# EAGLE design Schaltplan_6011057 Tamme (EAGLE 7.2.0)
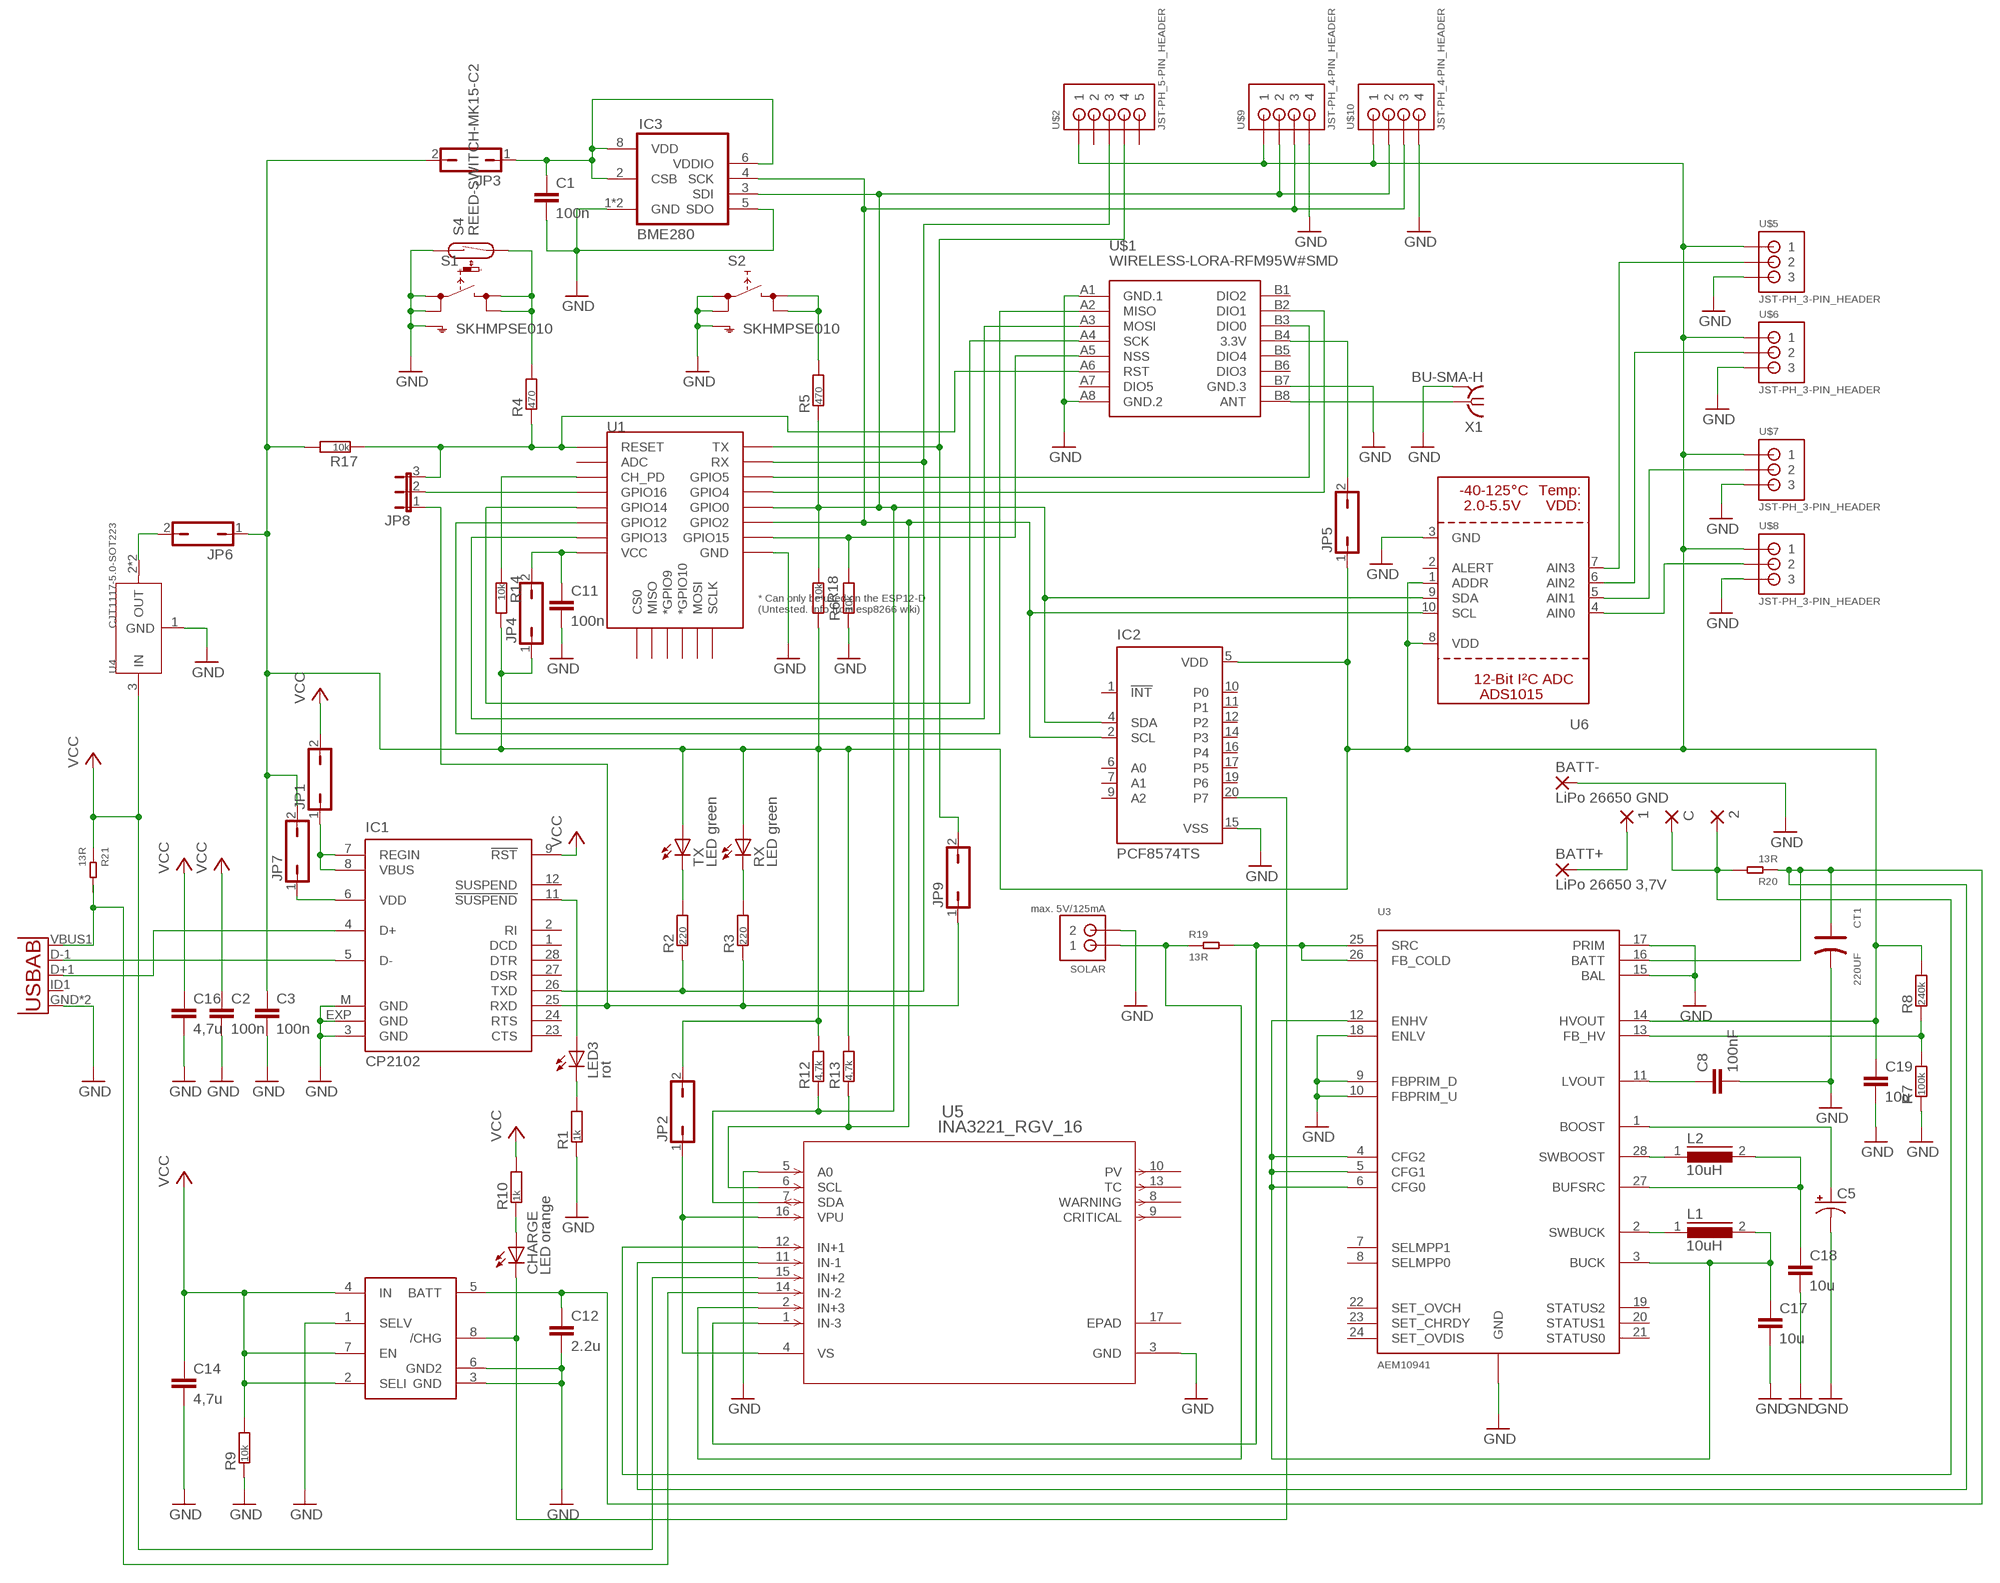
[diagram p0: schematic, sheet 1]

## Parts
1  WIREPAD2,54/1,0  [2,54/1,0]
2  WIREPAD2,54/1,0  [2,54/1,0]
BATT+  LiPo 26650 3,7V  WIREPAD4,16O1,6  [4,16O1,6]
BATT-  LiPo 26650 GND  WIREPAD4,16O1,6  [4,16O1,6]
C  WIREPAD2,54/1,0  [2,54/1,0]
C1  100n  CAPACITOR_0805_M  [RESC0805_M]
C2  100n  CAPACITOR_0805_M  [RESC0805_M]
C3  100n  CAPACITOR_0805_M  [RESC0805_M]
C5  CPOL-USB/3528-21W  [B/3528-21W]
C8  100nF  CC1206  [C1206]
C11  100n  CAPACITOR_0805_M  [RESC0805_M]
C12  2.2u  C-EUC1812  [C1812]
C14  4,7u  C-EUC1812  [C1812]
C16  4,7u  C-EUC1812  [C1812]
C17  10u  C-EUC1812  [C1812]
C18  10u  C-EUC1812  [C1812]
C19  10u  C-EUC1812  [C1812]
CHARGE  LED orange  LEDSMT1206  [1206]
CT1  220UF  ALUMINUM-SMD-220UF-16V(D6.3-H7.7MM)  [ELECTRO-SMD-C-6MM]
IC1  CP2102  [MLP28]
IC2  PCF8574TS  [SSOP20]
IC3  BME280  [BME280]
JP1  JP1Q  [JP1]
JP2  JP1Q  [JP1]
JP3  JP1Q  [JP1]
JP4  JP1Q  [JP1]
JP5  JP1Q  [JP1]
JP6  JP1Q  [JP1]
JP7  JP1Q  [JP1]
JP8  JP2E  [JP2]
JP9  JP1Q  [JP1]
L1  10uH  DR74  [DR74]
L2  10uH  DR74  [DR74]
LED3  rot  LEDSMT1206  [1206]
R1  1k  RESISTOR_0805_M  [RESC0805_M]
R2  220  RESISTOR_0805_M  [RESC0805_M]
R3  220  RESISTOR_0805_M  [RESC0805_M]
R4  470  RESISTOR_0805_M  [RESC0805_M]
R5  470  RESISTOR_0805_M  [RESC0805_M]
R6  10k  RESISTOR_0805_M  [RESC0805_M]
R7  100k  RESISTOR_0805_M  [RESC0805_M]
R8  240k  RESISTOR_0805_M  [RESC0805_M]
R9  10k  RESISTOR_0805_M  [RESC0805_M]
R10  1k  RESISTOR_0805_M  [RESC0805_M]
R12  4,7k  RESISTOR_0805_M  [RESC0805_M]
R13  4,7k  RESISTOR_0805_M  [RESC0805_M]
R14  10k  RESISTOR_0805_M  [RESC0805_M]
R17  10k  RESISTOR_0805_M  [RESC0805_M]
R18  10k  RESISTOR_0805_M  [RESC0805_M]
R19  13R  SMD-RES-13R-5%-1/4W(1206)  [R1206]
R20  13R  SMD-RES-13R-5%-1/4W(1206)  [R1206]
R21  13R  SMD-RES-13R-5%-1/4W(1206)  [R1206]
RX  LED green  LEDSMT1206  [1206]
S1  SKHMPSE010  [SKHMPXE010]
S2  SKHMPSE010  [SKHMPXE010]
S4  REED-SWITCH-MK15-C2  [MK15]
SOLAR  max. 5V/125mA  JST-PH_2-PIN_HEADER  [JST_B2B-PH_HEADER]
TX  LED green  LEDSMT1206  [1206]
U1  ESP12ESMD  [ESP12E-SMD]
U2  USB""  [USB-MICRO-SMD]
U3  AEM10941  [QFN28_5X5_05PITCH]
U4  CJT1117-5.0-SOT223  PMIC-CJT1117-5.0(SOT223)  [SOT-223]
U5  INA3221_RGV_16  [RGV16_2P16X2P16]
U6  ADC_ADS1015  [MSOP10]
U$1  WIRELESS-LORA-RFM95W#SMD  [WIRELESS-LORA-RFM95W#SMD]
U$2  JST-PH_5-PIN_HEADER  [JST_B5B-PH_HEADER]
U$3  MAX1811SO8  [SO08]
U$5  JST-PH_3-PIN_HEADER  [JST_B3B-PH_HEADER]
U$6  JST-PH_3-PIN_HEADER  [JST_B3B-PH_HEADER]
U$7  JST-PH_3-PIN_HEADER  [JST_B3B-PH_HEADER]
U$8  JST-PH_3-PIN_HEADER  [JST_B3B-PH_HEADER]
U$9  JST-PH_4-PIN_HEADER  [JST_B4B-PH_HEADER]
U$10  JST-PH_4-PIN_HEADER  [JST_B4B-PH_HEADER]
X1  BU-SMA-H  [BU-SMA-H]

## Nets
3.3V: C3.1 C19.1 IC2.5(VDD) JP2.2 JP3.2 JP4.1 JP5.1 JP6.1 JP7.2 R8.2 R12.2 R13.2 R14.2 R17.2 R18.2 RX.A TX.A U3.14(HVOUT) U6.1(ADDR) U6.8(VDD) U$2.P1 U$5.P1 U$6.P1 U$7.P1 U$8.P1 U$9.P1 U$10.P1
GND: BATT-.1(P) C1.2 C2.2 C3.2 C5.- C8.2 C11.2 C12.2 C14.2 C16.2 C17.2 C18.2 C19.2 CT1.- IC1.3(GND) IC1.EXP(GND) IC1.M(GND) IC2.15(VSS) IC3.1(GND) IC3.5(SDO) IC3.7(GND) R1.1 R6.1 R7.1 R9.1 S1.1(1.1) S1.2(1.2) S1.5(SH) S2.1(1.1) S2.2(1.2) S2.5(SH) S4.1 SOLAR.P2 U1.GND U2.GND U2.GND1(GND) U3.9(FBPRIM_D) U3.10(FBPRIM_U) U3.15(BAL) U3.17(PRIM) U3.18(ENLV) U3.GND U3.GND1(GND) U3.GND2(GND) U3.GND3(GND) U3.GND4(GND) U3.GND5(GND) U4.1(GND) U5.3(GND) U5.5(A0) U6.3(GND) U$1.A1(GND.1) U$1.A8(GND.2) U$1.B7(GND.3) U$3.1(SELV) U$3.3(GND) U$3.6(GND2) U$5.P3 U$6.P3 U$7.P3 U$8.P3 U$9.P4 U$10.P4 X1.2 X1.3 X1.4 X1.5
N$1: U$1.B8(ANT) X1.1
N$2: R6.2 U1.GPIO15 U$1.A5(NSS)
N$3: R4.2 S1.3(2.1) S1.4(2.2) S4.2
N$4: JP8.3 R4.1 R17.1 U1.RESET U$1.A6(RST)
N$5: IC1.4(D+) U2.D+1(D+)
N$6: IC1.5(D-) U2.D-1(D-)
N$7: JP8.2 U1.GPIO16
N$8: LED3.C R1.2
N$9: IC1.25(RXD) JP8.1 JP9.1 R3.1
N$10: IC1.26(TXD) R2.1 U1.RXD0(RX) U$2.P3
N$11: IC1.11(!SUSPEND) LED3.A
N$12: R2.2 TX.C
N$13: R3.2 RX.C
N$14: R5.2 S2.3(2.1) S2.4(2.2)
N$15: U1.GPIO12 U$1.A2(MISO)
N$16: U1.GPIO14 U$1.A4(SCK)
N$17: C12.1 CT1.+ R20.1 U3.16(BATT) U5.11(IN-1) U$3.5(BATT)
N$19: U1.GPIO13 U$1.A3(MOSI)
N$20: JP9.2 U1.TXD0(TX) U$2.P4
N$21: JP6.2 U4.2(OUT) U4.TER(OUT)
N$22: U6.4(AIN0) U$8.P2
N$23: C17.1 L1.2 U3.3(BUCK) U3.4(CFG2) U3.5(CFG1) U3.6(CFG0) U3.12(ENHV)
N$24: C5.+ U3.1(BOOST)
N$25: C18.1 L2.2 U3.27(BUFSRC)
N$26: R7.2 R8.1 U3.13(FB_HV)
N$27: C1.1 IC3.2(CSB) IC3.6(VDDIO) IC3.8(VDD) JP3.1
N$28: IC2.4(SDA) IC3.3(SDI) R5.1 R12.1 R18.1 U1.GPIO0 U5.7(SDA) U6.9(SDA) U$9.P2 U$10.P2
N$29: IC2.2(SCL) IC3.4(SCK) R13.1 U1.GPIO2 U5.6(SCL) U6.10(SCL) U$9.P3 U$10.P3
N$30: C8.1 U3.11(LVOUT)
N$31: 2.1(P) C.1(P) R20.2 U5.12(IN+1)
N$32: U6.5(AIN1) U$7.P2
N$33: U6.6(AIN2) U$6.P2
N$34: U6.7(AIN3) U$5.P2
N$36: R19.1 SOLAR.P1 U5.2(IN+3)
N$37: CHARGE.C IC2.20(P7) U$3.8(/CHG)
N$38: CHARGE.A R10.1
N$40: R19.2 U3.25(SRC) U3.26(FB_COLD) U5.1(IN-3)
N$41: U2.VBUS1(VBUS) U5.14(IN-2)
N$42: IC1.7(REGIN) IC1.8(VBUS) JP1.1
N$43: C11.1 JP4.2 U1.VCC
N$44: JP2.1 U5.4(VS) U5.16(VPU)
N$45: JP5.2 U$1.B4(3.3V)
N$46: U1.GPIO4 U$1.B2(DIO1)
N$47: U1.GPIO5 U$1.B3(DIO0)
N$49: L2.1 U3.28(SWBOOST)
N$50: L1.1 U3.2(SWBUCK)
N$52: R14.1 U1.CH_PD
N$59: IC1.6(VDD) JP7.1
N$60: 1.1(P) BATT+.1(P)
VCC: C2.1 C14.1 C16.1 IC1.9(!RST) JP1.2 R9.2 R10.2 R21.1 U4.3(IN) U5.15(IN+2) U$3.2(SELI) U$3.4(IN) U$3.7(EN)
Unconnected: IC1.1(DCD) IC1.2(RI) IC1.12(SUSPEND) IC1.23(CTS) IC1.24(RTS) IC1.27(DSR) IC1.28(DTR) IC2.1(!INT) IC2.6(A0) IC2.7(A1) IC2.9(A2) IC2.10(P0) IC2.11(P1) IC2.12(P2) IC2.14(P3) IC2.16(P4) IC2.17(P5) IC2.19(P6) R21.2 U1.ADC U1.CS0 U1.GPIO9(*GPIO9) U1.GPIO10(*GPIO10) U1.MISO U1.MOSI U1.SCLK U2.ID1(USBID) U3.7(SELMPP1) U3.8(SELMPP0) U3.19(STATUS2) U3.20(STATUS1) U3.21(STATUS0) U3.22(SET_OVCH) U3.23(SET_CHRDY) U3.24(SET_OVDIS) U5.8(WARNING) U5.9(CRITICAL) U5.10(PV) U5.13(TC) U5.17(EPAD) U6.2(ALERT) U$1.A7(DIO5) U$1.B1(DIO2) U$1.B5(DIO4) U$1.B6(DIO3) U$2.P2 U$2.P5

## Library data of the parts
1 2 BATT+ BATT- C = wirepad:WIREPAD: Wire PAD connect wire on PCB
C1-C3 C11 = Nordic_nRF:CAPACITOR: Generic chip capacitor
C5 = adafruit:CPOL-US: POLARIZED CAPACITOR, American symbol
C8 = eagle-ltspice:C: CAPACITOR, European symbol; SPICEMODEL: NONE; SPICEPREFIX: C
C12 C14 C16-C19 = rcl:C-EU: CAPACITOR, European symbol
CHARGE LED3 RX TX = led diymodules:LED: LED OSRAM: - CHIPLED LG R971, LG N971, LY N971, LG Q971, LY Q971, LO R971, LY R971 LH N974, LH R974 LS Q976, LO Q976, LY Q976 LO Q996 - Hyper CHIPLED LW Q18S LB Q993, LB Q99A, LB R99A - SideLED LS A670, LO A670, LY A670, LG A670, LP A670 LB A673, LV A673, LT A673, LW A673 LH A674 LY A675 LS A676, LA A676, LO A676, LY A676, LW A676 LS A679, LY A679, LG A679 - Hyper Micro SIDELED® LS Y876, LA Y876, LO Y876, LY Y876 LT Y87S - SmartLED LW L88C, LW L88S LB L89C, LB L89S, LG L890 LS L89K, LO L89K, LY L89K LS L896, LA L896, LO L896, LY L896 - TOPLED LS T670, LO T670, LY T670, LG T670, LP T670 LSG T670, LSP T670, LSY T670, LOP T670, LYG T670 LG T671, LOG T671, LSG T671 LB T673, LV T673, LT T673, LW T673 LH T674 LS T676, LA T676, LO T676, LY T676, LB T676, LH T676, LSB T676, LW T676 LB T67C, LV T67C, LT T67C, LS T67K, LO T67K, LY T67K, LW E67C LS E67B, LA E67B, LO E67B, LY E67B, LB E67C, LV E67C, LT E67C LW T67C LS T679, LY T679, LG T679 LS T770, LO T770, LY T770, LG T770, LP T770 LB T773, LV T773, LT T773, LW T773 LH T774 LS E675, LA E675, LY E675, LS T675 LS T776, LA T776, LO T776, LY T776, LB T776 LHGB T686 LT T68C, LB T68C - Hyper Mini TOPLED® LB M676 - Mini TOPLED Santana® LG M470 LS M47K, LO M47K, LY M47K Source: http://www.osram.convergy.de/
CT1 = Seeed-Capacitor:ALUMINUM-SMD-220UF-16V(D6.3-H7.7MM): 302030053; MPN: CS1E221M-CRE77
IC1 = silabs:CP210*: Single-Chip USB to UART Bridge Source: www.silabs.com .. CP2101.pdf / cp2102.pdf; MF: FARNELL; MPN: CP2102-GM; OC_FARNELL: 9282130; OC_NEWARK: 30K5635
IC2 = micro-philips:PCF8574: I2C-Bus Remote 8-bit I/O expander http://www.semiconductors.philips.com/acrobat_download/datasheets/PCF8574_4.pdf; MPN: PCF8574TS/3,118; OC_FARNELL: 1506644; OC_NEWARK: 70R6873
IC3 = bosch-bme280:BME280: DIGITAL HUMIDITY, PRESSURE AND TEMPERATURE SENSOR * Digital interface I²C (up to 3.4 MHz) and SPI (3 and 4 wire, up to 10 MHz)* Supply voltage VDD main supply voltage range: 1.71 V to 3.6 V*VDDIO interface voltage range: 1.2 V to 3.6 V Operating range -40…+85 °C, 0…100 % rel. humidity, 300…1100 hPa The library has been designed by Richard Magdycz <https://www.facebook.com/groups/eaglecadsoftUK>
JP1-JP7 JP9 = jumper:JP1Q: JUMPER
JP8 = jumper:JP2E: JUMPER
L1 L2 = inductors:DR74: High Power Density, High Efficiency, Shielded Inductors Source: coiltronics_dr_series.pdf
R1-R10 R12-R14 R17 R18 = Nordic_misc:RESISTOR: Generic chip resistor
R19-R21 = Seeed-Resistor:SMD-RES-13R-5%-1/4W(1206): 301010405; MPN: RC1206JR-0713RL
S1 S2 = switch:SKHMP*E010: 6.2 X 6.5mm TACT Switch (SMD) Source: http://www3.alps.co.jp/WebObjects/catalog.woa/PDF/E/Switch/Tact/SKHM/SKHM.PDF
S4 = switch-reed:REED-SWITCH-: Reed Sensor; MF: MEDER; MPN: MK15-C-2; OC_FARNELL: 1079485
SOLAR = srg:JST-PH_2-PIN_HEADER: 2-pin JST PH Shrouded Header, top entry P/N B2B-PH-K-S Mating connector PHR-2 Mating cable assembly: Sparkfun PRT-09914 <http://www.sparkfun.com/products/9914>
U1 = esp8266modules:ESP12E: ESP12E Module
U2 = MicroUSB Long GND:USB: This is a USB AB connector that is compatible with USB OTG. i.e. this connector can serve as a host or device
U3 = e-peas:AEM10941: AEM10941 – Energy Harvesting Power Management IC
U4 = Seeed-IC:PMIC-CJT1117-5.0(SOT223): 310030096; MPN: CJT1117-5.0
U5 = ina:INA3221_RGV_16; DATASHEETURL: http://www.ti.com/lit/gpn/INA3221; FAMILY_NAME: Standard CMV - Digital Output; GENERIC_PART_NUMBER: INA3221; INDUSTRY_STD_PKG_TYPE: VQFN; MANUFACTURER: Texas Instruments; PACKAGE_DESIGNATOR: RGV; PIN_COUNT: 16
U6 = microbuilder:ADC_ADS1015: ADS1015 - 12-bit 4-Channel I2C ADC with Internal PGA VDD: 2.0-5.5V Sampling Rate: 3.3ksps Gain Settings: 2/3, 1, 2, 4, 8, 16 I2C Address: ADDR low = 1001000x, ADDR high = 1001001x Internal Comparator The ADS1015 includes an internal comparator that can be set to output a high-level on ALERT when the conversion results exceeeds a pre-defined upper level, and will deassert itself when the level falls below a pre-defined lower threshold level. It can also be set to windowed mode where the ALERT pin will be asserted if the data exceeds the upper threshold or falls below the lower threshold.
U$1 = diy-modules:WIRELESS-LORA-RFM95W: 868/915 MHz LoRa Radio Transceiver Module based on SX1276 chip Click here to find device on ebay.com <http://www.ebay.com/sch/RFM95W+transceiver>
U$2 = srg:JST-PH_5-PIN_HEADER: 5-pin JST PH Shrouded Header, top entry P/N B5B-PH-K-S Mating connector PHR-5 Mating cable assembly: Sparkfun PRT-09917 <http://www.sparkfun.com/products/9917>
U$3 = adafruit:MAX1811: Maxim MAX1811 USB li-ion battery charger http://www.ladyada.net/library/eagle
U$5-U$8 = srg:JST-PH_3-PIN_HEADER: 3-pin JST PH Shrouded Header, top entry P/N B3B-PH-K-S Mating connector PHR-3
U$9 U$10 = srg:JST-PH_4-PIN_HEADER: 4-pin JST PH Shrouded Header, top entry P/N B4B-PH-K-S Mating connector PHR-4 Mating cable assembly: Sparkfun PRT-09916 <http://www.sparkfun.com/products/9916>
X1 = con-coax:BU-SMA-H: FEMALE SMA CONNECTOR Radiall; OC_FARNELL: unknown; OC_NEWARK: unknown

## Board
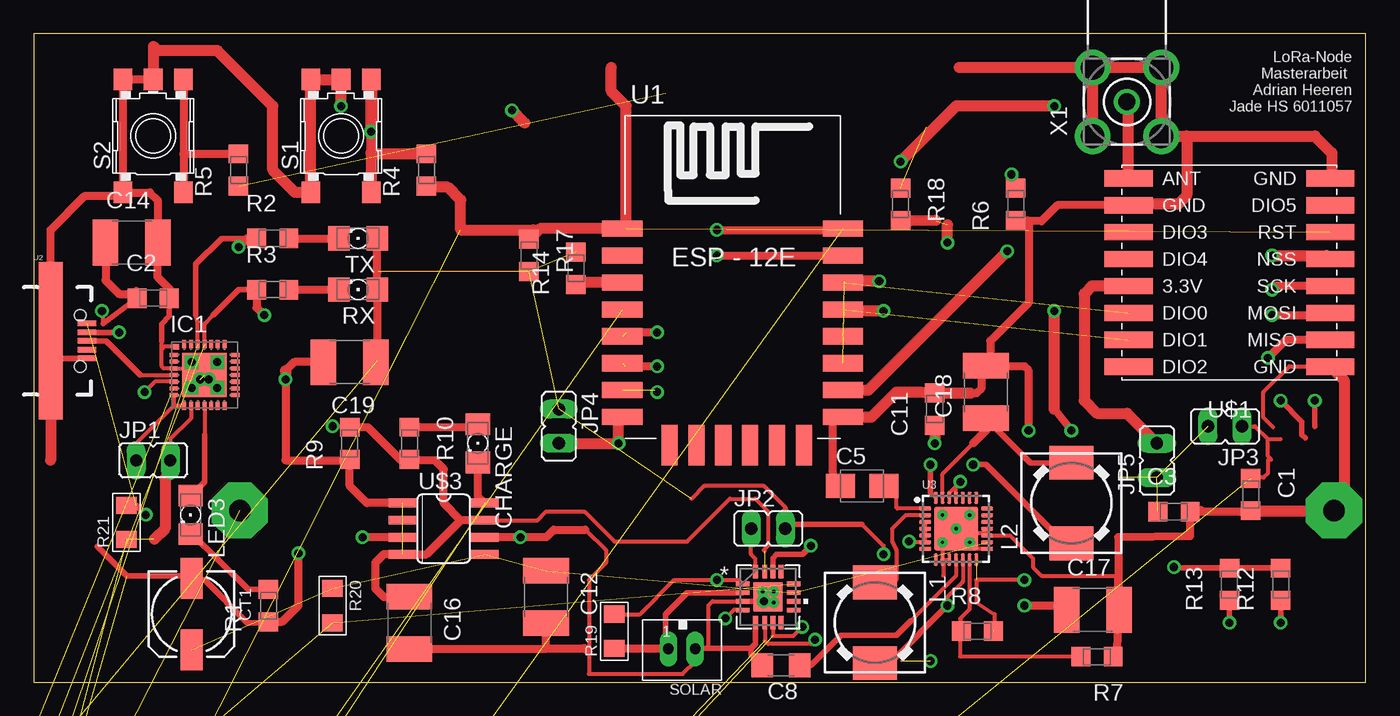
[diagram p1: board, top side]
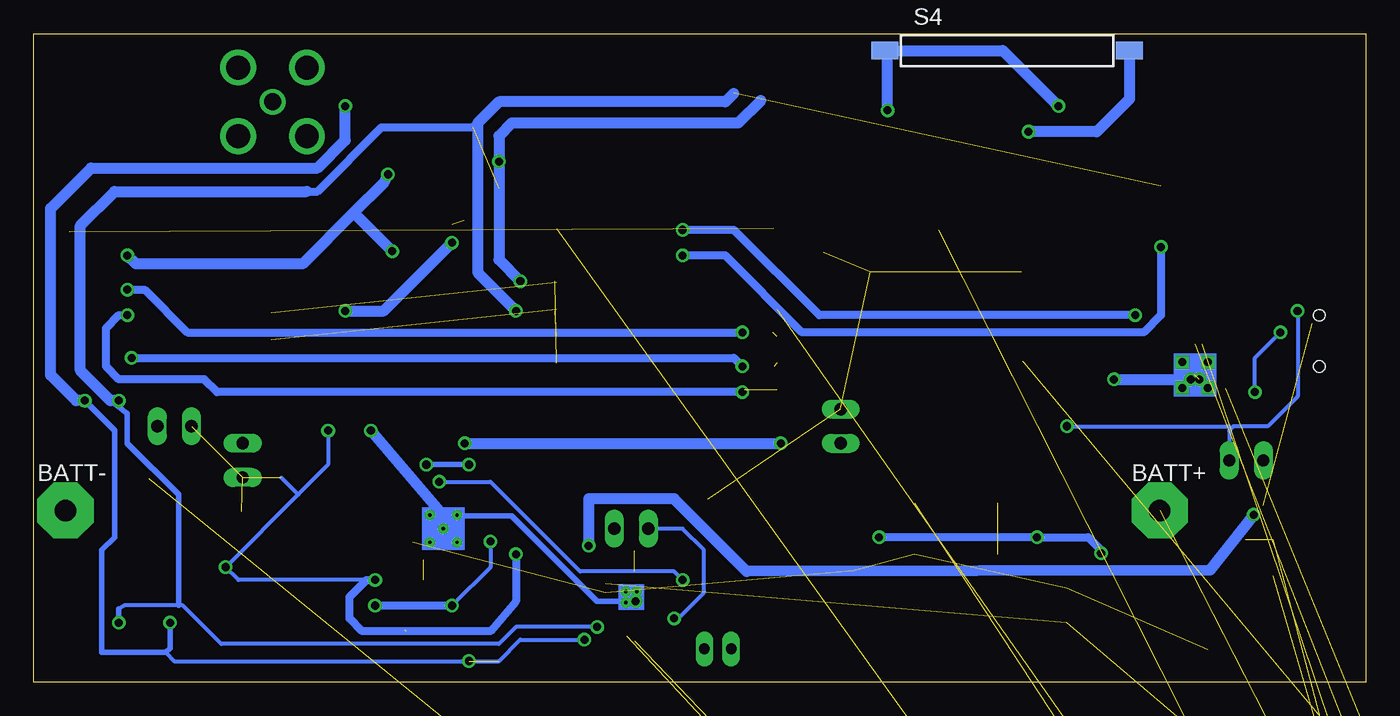
[diagram p2: board, bottom side, seen from below]

Size 99.05 x 48.25 mm. Coordinates in mm from the lower left corner, seen from the top.
Outline: 0,0 99.05,0 99.05,48.25 0,48.25 0,0
Copper layers (1*16): Top 0.035mm / dielectric 1.5mm / Bottom 0.035mm
Design rules "default *": minimum track width 10mil, minimum drill 24mil, track to track 8mil, track to pad 8mil, pad to pad 8mil, via to via 8mil, smd to smd 8mil, copper to edge 12mil, drill to drill 8mil, minimum pad ring 10mil, minimum via ring 8mil, stop-mask expansion 4mil, vias tented up to drill 0mil, thermal gap 10mil

### Footprints (pad centres in the part's own frame; a part is rotated, then mirrored left to right if it is on the bottom)
2,54/1,0 = drill 1.016 pad 2.54 octagon: 1 0,0
4,16O1,6 = drill 1.6 pad 4.166 octagon: 1 0,0
RESC0805_M = smd 1.4 x 1.45: 1 -1.2,0; 2 1.2,0
B/3528-21W = smd 2.15 x 1.8: + 1.625,0; - -1.625,0
C1206 = smd 1.6 x 1.8: 1 -1.4,0; 2 1.4,0
C1812 = smd 1.9 x 3.4: 1 -1.95,0; 2 1.95,0
1206 = smd 1.6 x 1.803: A -1.422,0; C 1.422,0
ELECTRO-SMD-C-6MM = smd 3.048 x 1.651: + 2.667,0; - -2.667,0
MLP28 = smd 0.6 x 0.3: 1 -2.3,1.5; 2 -2.3,1; 3 -2.3,0.5; 4 -2.3,0; 5 -2.3,-0.5; 6 -2.3,-1; 7 -2.3,-1.5; 15 2.3,-1.5; 16 2.3,-1; 17 2.3,-0.5; 18 2.3,0; 19 2.3,0.5; 20 2.3,1; 21 2.3,1.5 | smd 0.3 x 0.6: 8 -1.5,-2.3; 9 -1,-2.3; 10 -0.5,-2.3; 11 0,-2.3; 12 0.5,-2.3; 13 1,-2.3; 14 1.5,-2.3; 22 1.5,2.3; 23 1,2.3; 24 0.5,2.3; 25 0,2.3; 26 -0.5,2.3; 27 -1,2.3; 28 -1.5,2.3 | smd 3.3 x 3.3: EXP 0,0 | smd 0.435 x 0.435: M -2.103,2.103
SSOP20 = smd 0.35 x 1.2: 1 -2.925,-2.85; 2 -2.275,-2.85; 3 -1.625,-2.85; 4 -0.975,-2.85; 5 -0.325,-2.85; 6 0.325,-2.85; 7 0.975,-2.85; 8 1.625,-2.85; 9 2.275,-2.85; 10 2.925,-2.85; 11 2.925,2.85; 12 2.275,2.85; 13 1.625,2.85; 14 0.975,2.85; 15 0.325,2.85; 16 -0.325,2.85; 17 -0.975,2.85; 18 -1.625,2.85; 19 -2.275,2.85; 20 -2.925,2.85
BME280 = smd 0.35 x 0.5: 1 0.975,-1.025; 2 0.325,-1.025; 3 -0.325,-1.025; 4 -0.975,-1.025; 5 -0.975,1.025; 6 -0.325,1.025; 7 0.325,1.025; 8 0.975,1.025
JP1 = drill 0.914 long: 1 0,-1.27; 2 0,1.27
JP2 = drill 0.914 long: 1 -2.54,0; 2 0,0; 3 2.54,0
DR74 = smd 2.5 x 3.25: 1 -3,0; 2 3,0
R1206 = smd 1.27 x 1.524: 1 -1.27,0; 2 1.27,0
SKHMPXE010 = smd 1.6 x 1.4: 1 -4.2,2.25; 2 4.2,2.25; 3 -4.2,-2.25; 4 4.2,-2.25; 5 4.2,0
MK15 = smd 2 x 1.3: 1 -9.1,0; 2 9.1,0
JST_B2B-PH_HEADER = drill 0.8 long: P1 1.075,0.048; P2 -0.925,0.048
ESP12E-SMD = smd 3 x 1.2: ADC -8.3,3.8; CH_PD -8.3,1.8; GND 8.1,-8.2; GPIO0 8.1,-2.2; GPIO2 8.1,-4.2; GPIO4 8.1,-0.2; GPIO5 8.1,1.8; GPIO12 -8.3,-4.2; GPIO13 -8.3,-6.2; GPIO14 -8.3,-2.2; GPIO15 8.1,-6.2; GPIO16 -8.3,-0.2; RESET -8.3,5.8; RXD0 8.1,3.8; TXD0 8.1,5.8; VCC -8.3,-8.2 | smd 1.2 x 3: CS0 -4.8,-10.3; GPIO9 -0.8,-10.3; GPIO10 1.2,-10.3; MISO -2.8,-10.3; MOSI 3.2,-10.3; SCLK 5.2,-10.3
USB-MICRO-SMD = smd 1.4 x 0.4: D+1 2.7,0; D-1 2.7,0.65; GND1 2.7,-1.3; ID1 2.7,-0.65; VBUS1 2.7,1.3 | smd 1.778 x 11.684: GND 0,0 | hole 0.85: 2.2,1.9; 2.2,-1.9
QFN28_5X5_05PITCH = smd 0.9 x 0.3: 1 -2.3,1.5; 2 -2.3,1; 3 -2.3,0.5; 4 -2.3,0; 5 -2.3,-0.5; 6 -2.3,-1; 7 -2.3,-1.5; 15 2.3,-1.5; 16 2.3,-1; 17 2.3,-0.5; 18 2.3,0; 19 2.3,0.5; 20 2.3,1; 21 2.3,1.5 | smd 0.3 x 0.9: 8 -1.5,-2.3; 9 -1,-2.3; 10 -0.5,-2.3; 11 0,-2.3; 12 0.5,-2.3; 13 1,-2.3; 14 1.5,-2.3; 22 1.5,2.3; 23 1,2.3; 24 0.5,2.3; 25 0,2.3; 26 -0.5,2.3; 27 -1,2.3; 28 -1.5,2.3 | smd 3.25 x 3.25: GND 0,0 | drill 0.25: GND1 0,0; GND2 1.016,1.016; GND3 1.016,-1.016; GND4 -1.016,-1.016; GND5 -1.016,1.016
SOT-223 = smd 1.27 x 2.286: 1 -2.286,-3.175; 2 0,-3.175; 3 2.286,-3.175 | smd 3.556 x 2.159: TER 0,3.175
RGV16_2P16X2P16 = smd 1 x 0.35: 1 -1.9,0.975; 2 -1.9,0.325; 3 -1.9,-0.325; 4 -1.9,-0.975; 9 1.9,-0.975; 10 1.9,-0.325; 11 1.9,0.325; 12 1.9,0.975 | smd 0.35 x 1: 5 -0.95,-1.9; 6 -0.25,-1.9; 7 0.35,-1.9; 8 0.95,-1.9; 13 0.95,1.9; 14 0.35,1.9; 15 -0.25,1.9; 16 -0.95,1.9 | smd 2.16 x 2.16: 17 0,0 | drill 0.254 pad 0.508: V -0.406,-0.406; V_1 -0.406,0.406; V_2 0.406,-0.406; V_3 0.406,0.406
MSOP10 = smd 0.25 x 1: 1 -1,-2.113; 2 -0.5,-2.113; 3 0,-2.113; 4 0.5,-2.113; 5 1,-2.113; 6 1,2.113; 7 0.5,2.113; 8 0,2.113; 9 -0.5,2.113; 10 -1,2.113
WIRELESS-LORA-RFM95W#SMD = smd 3.6 x 1.2: A1 -7.5,7; A2 -7.5,5; A3 -7.5,3; A4 -7.5,1; A5 -7.5,-1; A6 -7.5,-3; A7 -7.5,-5; A8 -7.5,-7; B1 7.5,7; B2 7.5,5; B3 7.5,3; B4 7.5,1; B5 7.5,-1; B6 7.5,-3; B7 7.5,-5; B8 7.5,-7
JST_B5B-PH_HEADER = drill 0.8 long: P1 4,0.048; P2 2,0.048; P3 0,0.048; P4 -2,0.048; P5 -4,0.048
SO08 = smd 0.66 x 2.032: 1 -1.905,-3.073; 2 -0.635,-3.073; 3 0.635,-3.073; 4 1.905,-3.073; 5 1.905,3.073; 6 0.635,3.073; 7 -0.635,3.073; 8 -1.905,3.073
JST_B3B-PH_HEADER = drill 0.8 long: P1 2.027,0.048; P2 0.028,0.048; P3 -1.972,0.048
JST_B4B-PH_HEADER = drill 0.8 long: P1 2.98,0.048; P2 0.98,0.048; P3 -1.02,0.048; P4 -3.02,0.048
BU-SMA-H = drill 1.27: 1 0,0 | drill 1.778: 2 -2.55,2.55; 3 2.55,2.55; 4 2.55,-2.55; 5 -2.55,-2.55

### Placement (x,y rotation side)
1  -5.95,-28.73 0 top  (outside the outline)
2  -5.95,-19.53 0 top  (outside the outline)
BATT+  15.32,12.78 0 bottom
BATT-  96.68,12.78 0 bottom
C  -5.95,-24.13 0 top  (outside the outline)
C1  90.49,13.97 270 top
C2  8.89,28.57 0 top
C3  84.77,12.7 0 top
C5  61.59,14.61 0 top
C8  55.56,1.27 180 top
C11  66.99,20.32 90 top
C12  38.1,6.35 270 top
C14  7.3,32.7 0 top
C16  27.94,4.45 270 top
C17  78.74,5.4 0 top
C18  70.8,21.59 90 top
C19  23.5,23.81 180 top
CHARGE  33.02,17.78 270 top
CT1  11.75,5.08 270 top
IC1  12.7,22.86 0 top
IC2  -33.81,-96.92 0 top  (outside the outline)
IC3  -30.8,-83.74 0 top  (outside the outline)
JP1  8.89,16.51 270 top
JP2  54.61,11.43 270 top
JP3  88.58,19.05 90 top
JP4  39.05,19.05 180 top
JP5  83.5,16.51 0 top
JP6  -26.11,-71.83 0 top  (outside the outline)
JP7  -4.45,-13.18 0 top  (outside the outline)
JP8  -18.57,-60.96 0 top  (outside the outline)
JP9  -36.04,-88.98 0 top  (outside the outline)
L1  62.55,4.45 270 top
L2  77.15,13.34 90 top
LED3  11.67,12.46 270 top
R1  17.46,5.71 90 top
R2  17.78,33.02 0 top
R3  17.78,29.21 0 top
R4  29.21,38.1 90 top
R5  15.24,38.1 90 top
R6  73.03,35.56 90 top
R7  79.06,1.91 180 top
R8  70.17,3.81 0 top
R9  23.5,17.78 90 top
R10  27.94,17.78 270 top
R12  92.71,7.3 90 top
R13  88.9,7.3 90 top
R14  40.32,30.8 90 top
R17  36.83,31.75 270 top
R18  64.45,35.56 270 top
R19  43.18,3.81 90 top
R20  22.23,5.71 270 top
R21  6.91,11.91 90 top
RX  24.13,29.21 180 top
S1  22.86,40.64 90 top
S2  8.89,40.64 90 top
S4  26.67,46.99 0 bottom
SOLAR  48.26,2.54 180 top
TX  24.13,33.02 180 top
U1  52.07,27.94 0 top
U2  1.27,25.4 0 top
U3  68.58,11.43 0 top
U4  -17.62,-70.41 0 top  (outside the outline)
U5  54.61,6.35 0 top
U6  -26.51,-77.79 0 top  (outside the outline)
U$1  88.9,30.48 180 top
U$2  -26.51,-89.85 0 top  (outside the outline)
U$3  30.48,11.43 270 top
U$5  -3.25,-33.89 0 top  (outside the outline)
U$6  -3.25,-39.85 0 top  (outside the outline)
U$7  -3.25,-45.8 0 top  (outside the outline)
U$8  -3.25,-51.75 0 top  (outside the outline)
U$9  -2.7,-57.71 0 top  (outside the outline)
U$10  -2.7,-63.66 0 top  (outside the outline)
X1  81.28,43.18 90 top

### Tracks (layer width: path | path; a pad name or v marks a point on that pad's centre or on a via)
3.3V  (via drill 0.6)  (23 unrouted)
  Top 0.305: 71.44,3.88 71.44,5.08 70.08,5.95 70.08,7.62 v73.66,7.62 | 55.88,12.7 55.88,13.02 54.29,14.61 49.85,14.61 48.9,13.65 | 25.62,30.55 25.55,30.48 | 61.59,11.75 63.18,10.16 v63.18,9.53
  Top 0.406: R12.2 R13.2 84.84,8.5 v84.77,8.57 | 61.59,11.75 55.88,11.75
  Top 0.61: TX.A 25.55,30.48 RX.A 25.55,23.92 | 55.88,12.7 55.88,11.75 JP2.2 | 75.88,20.32 v77.15,18.73
  Top 0.813: 67.06,34.36 65.09,34.29 R18.2 | 75.88,20.32 v75.88,27.62 | v67.94,32.7 67.94,34.04
  Bottom 0.305: v73.66,7.62 83.82,7.62 v84.77,8.57 79.38,13.97 | v77.15,18.73 77.15,16.19 79.38,13.97 | 80.64,15.24 79.38,13.97
  Bottom 0.61: v63.18,9.53 63.18,6.03 65.09,3.81 74.61,3.81 75.56,4.76 75.56,6.35 74.3,7.62 v73.66,7.62
  Bottom 0.813: v75.88,27.62 73.03,27.62 v67.94,32.7
GND  (via drill 0.6)  (14 unrouted)
  Top 0.305: 9.53,24.77 9.53,23.5 9.66,23.36 IC1.3 11.56,23.36 v12.38,22.54 | 9.53,24.77 9.53,25.4 | IC1.M 9.72,24.96 9.53,24.77 | U3.9 67.56,9.15 U3.GND4 U3.GND1 | U3.9 U3.10 | U3.9 67.63,9.08 67.63,7.94 | 97.4,16.58 97.47,16.51 | U3.17 72.57,10.93 74.3,9.21 74.3,8.57 74.93,7.94 80.64,7.94 | U3.17 U3.18 | U3.15 70.08,9.93 U3.GND3 | U3.GND3 69.6,10.86 69.85,11.11 | 69.85,11.11 70.7,11.11 U3.17 | 69.85,11.11 69.85,12.19 U3.GND2 | U3.GND1 U3.GND3 | U3.GND1 U3.GND5 | 50.16,2.54 50.16,5.71 50.48,6.03 52.7,6.03 U5.3 | 41.03,11.36 42.55,9.84 42.55,8.89 41.27,7.62 41.27,2.22 41.27,0.64 48.26,0.64 49.21,1.59 49.21,2.46 SOLAR.P2 | C1.2 90.49,12.7 | 92.14,18.98 91.44,19.68 91.44,21.59 93.34,23.5 96.39,23.5 U$1.A1 | 59.37,15.25 59.37,15.2 C5.-
  Top 0.406: U2.GND1 1.3,24.1 1.27,24.13 U2.GND | C2.2 10.09,27.23 9.53,26.67 9.53,25.4 | U5.5 53.66,2.86 53.34,2.54 | 53.34,2.54 50.16,2.54 49.23,2.54 SOLAR.P2 | 19.68,5.71 18.41,4.45 | 53.34,2.54 53.34,2.09 C8.2 | U5.3 52.7,6.03 v54.29,6.03 | 4.71,10.13 6.91,7.94 11.56,7.94 CT1.- 11.75,7.62 12.7,7.62 15.88,4.45 17.39,4.45 R1.1
  Top 0.61: S2.5 S2.2 S2.1 | S2.1 8.64,36.44 9.21,35.88 9.21,32.75 C14.2 9.21,32.66 9.21,30.16 10.09,29.28 C2.2 | U2.GND 1.27,33.66 3.81,36.2 6.39,36.2 S2.1 | U$3.1 24.77,13.34 23.5,14.61 R9.1 23.43,16.51 18.73,16.51 v18.73,22.54 | R1.1 18.48,4.51 19.68,5.71 v19.68,9.6 | 86.81,12.82 C3.2 | C3.2 90.49,12.7 | C3.2 85.97,10.87 80.64,10.79 80.64,7.94 80.64,7.67 C17.2 80.64,7.58 80.64,5.4 80.58,2.15 R7.1 | U$3.3 v24.45,10.79 | U$3.6 v36.2,10.79 38.1,10.79 38.66,11.36 41.03,11.36 | 62.28,19.74 59.43,19.74 59.37,19.68 59.37,15.25 | C19.2 19.37,23.81 18.73,23.18 | 69.65,21.52 70.1,21.52 70.48,21.91 70.48,23.22 C18.2 | U$1.B7 76.12,35.48 74.93,34.29 73.98,34.29 | 73.98,34.29 73.09,34.29 R6.1 73.91,34.36 73.98,34.29 | 73.98,34.29 73.98,28.26 71.12,25.4 71.12,23.86 C18.2 | v73.98,18.73 73.98,23.18 73.66,23.5 70.85,23.5 C18.2 | C16.2 38.05,2.5 38.1,2.54 | 38.1,2.54 C12.2 | 38.1,2.54 40.96,2.54 41.27,2.22
  Top 0.813: X1.5 X1.4 X1.3 | X1.3 X1.2 | X1.3 68.81,45.73 | X1.5 95.26,40.63 96.52,39.37 96.52,37.6 U$1.A8 | X1.5 85.72,40.63 85.72,40.64 85.72,36.2 85.09,35.56 81.48,35.56 U$1.B7 | 69.65,21.52 C11.2 65.97,21.59 64.14,21.59 62.28,19.74 U1.GND | S2.5 8.89,47.31 9.21,46.99 13.65,46.99 17.78,42.86 17.78,38.1 19.44,36.44 S1.1 S1.2 S1.5 v22.86,42.86 | U$1.A1 97.47,22.41 97.47,16.51 97.47,14.29 BATT-.1 95.81,12.77 C1.2 | 36.5,41.6 v35.56,42.55 | 18.73,23.18 v18.73,22.54 | v13.02,22.54 IC1.EXP
  Bottom 0.406: v54.29,6.03 57.15,6.03 63.5,12.38 67.5,12.38 U3.GND5
  Bottom 0.61: v36.2,10.79 v24.45,10.79 20.64,10.79 19.68,9.84 v19.68,9.6
  Bottom 0.813: v22.86,42.86 26.99,46.99 S4.1 35.56,46.78 v35.56,42.55 | U3.GND5 68.64,12.45 v73.98,18.73 | v18.73,22.54 v13.02,22.54
N$1
  Top 0.813: U$1.B8 81.4,43.06 X1.1
N$2  (via drill 0.6)
  Top 0.813: R6.2 v72.71,37.78 | v92.08,31.75 96.13,31.75 U$1.A5 | U1.GPIO15 62.06,21.74 v72.39,32.07
  Bottom 0.813: v72.71,37.78 73.03,37.15 75.25,34.92 | 75.25,34.92 79.06,31.11 91.44,31.11 v92.08,31.75 | v72.39,32.07 75.25,34.92
N$3  (via drill 0.6)
  Top 0.813: v25.08,40.96 25.08,44.81 S1.4 25.11,39.4 25.08,39.37 | R4.2 25.15,39.3 25.08,39.37 | 25.08,39.37 25.08,36.47 S1.3
  Bottom 0.813: S4.2 17.57,43.39 20,40.96 v25.08,40.96
N$4  (2 unrouted)
  Top 0.813: R4.1 29.28,36.83 30.8,36.83 31.75,35.88 31.75,33.66 37.15,33.66 37.34,33.46 | 37.34,33.46 37.62,33.74 U1.RESET 44.05,33.74 44.05,42.86 42.94,43.97 42.94,45.72 | 37.34,33.46 R17.1
N$5
  Top 0.305: 7.94,22.86 IC1.4
  Top 0.406: U2.D+1 5.4,25.4 7.94,22.86
N$6  (via drill 0.6)
  Top 0.305: IC1.5 9.03,22.36 v8.26,21.59
  Top 0.406: v6.35,26.04 3.98,26.04 U2.D-1
  Bottom 0.305: v8.26,21.59 8.26,24.13 v6.35,26.04
N$7  (1 unrouted)
N$8
  Top 0.406: R1.2 15.95,6.91 11.67,11.11 LED3.C
N$9  (via drill 0.6)  (2 unrouted)
  Top 0.305: IC1.25 12.7,26.67 13.34,27.3
  Top 0.406: 13.34,27.3 15.24,29.21 R3.1
  Top 0.61: R3.1 16.58,27.87 v17.14,27.3 | v50.8,33.66 60.09,33.66
  Bottom 0.61: v17.14,27.3 40.64,27.3 46.99,33.66 v50.8,33.66
N$10  (via drill 0.6)  (1 unrouted)
  Top 0.305: IC1.26 12.2,26.8 12.06,27.3
  Top 0.406: 12.06,27.3 12.06,31.11 13.97,33.02 R2.1
  Top 0.61: R2.1 15.88,33.02 v15.24,32.38 | v50.8,31.75 U1.RXD0
  Bottom 0.61: v15.24,32.38 15.24,27.3 16.51,26.04 41.91,26.04 47.62,31.75 v50.8,31.75
N$11
  Top 0.305: IC1.11 12.7,18.41
  Top 0.406: 12.7,18.41 12.7,14.92 LED3.A
N$12
  Top 0.61: R2.2 TX.C
N$13
  Top 0.61: R3.2 RX.C
N$14
  Top 0.61: S2.4 11.14,39.3 | 11.14,39.3 S2.3 | R5.2 11.14,39.3
N$15  (via drill 0.6)  (1 unrouted)
  Top 0.61: U$1.A2 93.11,25.48 v91.76,24.13 | v46.35,23.5 44.02,23.5
  Bottom 0.61: v91.76,24.13 46.99,24.13 v46.35,23.5
N$16  (via drill 0.6)  (1 unrouted)
  Top 0.61: U$1.A4 92.34,29.48 v92.08,29.21 | v46.35,26.04 44.06,26.04
  Bottom 0.61: v92.08,29.21 90.81,29.21 87.63,26.04 v46.35,26.04
N$17  (5 unrouted)
N$19  (via drill 0.6)  (1 unrouted)
  Top 0.61: 46.2,21.74 v46.35,21.59 | v92.08,27.3 96.22,27.3 U$1.A3
  Bottom 0.61: v46.35,21.59 85.41,21.59 86.36,22.54 92.71,22.54 93.66,23.5 93.66,26.35 92.71,27.3 v92.08,27.3
N$20  (2 unrouted)
N$21  (2 unrouted)
N$22  (1 unrouted)
N$23  (via drill 0.6)
  Top 0.305: v67.94,5.71 67.94,6.35 69.08,7.49 U3.12 | U3.3 U3.4 U3.5 U3.6 65.14,10.43 v65.09,10.48
  Top 0.406: v67.94,5.71 63.82,1.59 62.69,1.59 L1.2
  Top 0.61: v73.66,5.71 76.52,5.71 C17.1
  Bottom 0.305: v65.09,10.48 65.09,8.57 v67.94,5.71
  Bottom 0.61: v73.66,5.71 v67.94,5.71
N$24
  Top 0.305: U3.1 64.22,12.93 64.14,13.02 64.14,14.91 63.53,14.91 C5.+
N$25
  Top 0.305: U3.27 67.58,15.51 69.85,17.78
  Top 0.406: L2.2 74.11,16.34 C18.1
  Top 0.61: 69.85,17.78 70.8,18.73 C18.1
N$26
  Top 0.305: U3.13 69.58,5.45 68.9,4.76 68.9,3.88 R8.1 68.9,3.74 68.9,1.91 R7.2
N$27  (3 unrouted)
  Top 0.305: 91.76,18.1 91.76,16.83 92,16.58 91.83,16.58 91.76,16.51 91.76,15.56 91.44,15.24 90.56,15.24 C1.1 | 91.76,18.1 92.7,18.1 | JP3.1 90.81,19.05 91.76,18.1
N$28  (via drill 0.6)  (8 unrouted)
  Top 0.305: U5.7 54.96,3.46 56.48,3.46 v57.15,4.13
  Top 0.406: 94.53,18.18 94.3,18.41 94.3,19.37 v92.71,20.95 | v92.71,4.45 R12.1
  Top 0.813: v63.18,27.62 60.29,27.62
  Bottom 0.305: v57.15,4.13 63.18,4.13 64.45,2.86 85.09,2.86 87.95,5.71 88.27,5.71 92.32,5.71 92.71,5.47
  Bottom 0.406: 92.71,5.47 v92.71,4.45 | 93.34,20.95 92.08,20 92.08,17.78 88.27,13.97 88.27,5.71
  Bottom 0.61: 78.74,36.51 77.95,36.51 73.18,41.27 66.36,41.27 66.04,41.59
  Bottom 0.813: 46.99,43.81 47.62,43.18 64.45,43.18 66.04,41.59 66.04,30.48 v63.18,27.62 | v92.71,20.95 93.34,20.95 95.57,23.18 95.57,33.97 93.03,36.51 78.74,36.51
N$29  (via drill 0.6)  (7 unrouted)
  Top 0.305: v58.1,3.17 57.78,2.86 54.61,2.86 54.36,3.11 U5.6
  Top 0.406: v95.25,20.95 95.25,19.05 | R13.1 v88.9,4.45
  Top 0.813: v62.87,29.84 60.27,29.84 | v75.88,42.86 68.58,42.86 v64.45,38.73
  Bottom 0.305: 89.22,2.22 88.58,1.59 64.45,1.59 62.87,3.17 v58.1,3.17
  Bottom 0.406: v88.9,4.45 88.9,2.54 89.22,2.22 93.98,2.22 93.98,9.84 93.03,10.79 93.03,18.73 v95.25,20.95 95.25,20.64
  Bottom 0.813: 44.99,43.27 46.67,41.59 63.5,41.59 64.45,40.64 v64.45,38.73 64.45,31.43 v62.87,29.84 | v95.25,20.95 95.89,20.95 97.79,22.86 97.79,35.24 94.77,38.26 77.95,38.26 75.88,40.32 v75.88,42.86
  other vias: 66.67,1.59
N$30
  Top 0.305: U3.11 68.58,7.94 65.22,4.58
  Top 0.406: C8.1 57.78,1.27 60.01,3.49 64.14,3.49 65.22,4.58
N$31  (3 unrouted)
N$32  (1 unrouted)
N$33  (1 unrouted)
N$34  (1 unrouted)
N$36
  Top 0.406: U5.2 48.59,6.67 46.99,5.08 46.99,2.69 SOLAR.P1
  Top 0.61: SOLAR.P1 43.23,2.49 R19.1
N$37  (1 unrouted)
  Top 0.61: CHARGE.C 33.02,13.87 U$3.8
N$38
  Top 0.61: R10.1 32.8,18.98 CHARGE.A
N$40  (via drill 0.6)
  Top 0.305: R19.2 45.09,5.08 47.62,7.62 v50.8,7.62 52.41,7.62 U5.1 | U3.26 68.08,14.11 v68.9,14.92 68.58,14.61 U3.25
  Bottom 0.305: v68.9,14.92 65.09,14.92 58.42,8.26 51.44,8.26 v50.8,7.62
N$41  (via drill 0.6)  (1 unrouted)
  Top 0.406: v57.78,10.16 57.15,9.53 55.24,9.53 54.96,9.24 U5.14 | 7.62,13.18 v8.33,12.46
  Bottom 0.813: v8.33,12.46 11.59,8.33 46.04,8.26 51.44,13.65 57.78,13.65 v57.78,10.16
N$42
  Top 0.305: IC1.8 10.4,20.56 | 10.4,20.56 7.62,17.78 JP1.1 | IC1.7 10.4,20.56
N$43  (via drill 0.6)
  Top 0.813: C11.1 v66.99,17.78 | U1.VCC 43.5,19.47 v43.5,17.78 JP4.2
  Bottom 0.813: v66.99,17.78 v43.5,17.78
N$44  (via drill 0.6)
  Top 0.305: U5.16 53.66,9.21 53.34,9.53 JP2.1 | U5.4 52.71,5.39 52.7,5.4 52.07,5.4 v51.44,4.76
  Bottom 0.305: v51.44,4.76 51.12,4.76 49.21,6.67 49.21,9.84 50.8,11.43 JP2.1
N$45
  Top 0.813: U$1.B4 78.69,29.48 78.11,28.89 78.11,20.95 79.06,20 81.28,20 JP5.2
N$46  (1 unrouted)
N$47  (1 unrouted)
N$49  (via drill 0.6)
  Top 0.305: U3.28 66.67,14.13
  Top 0.406: L2.1 76.66,10.34 70.8,16.19 v69.85,16.19 | v66.67,16.19 66.67,14.13
  Bottom 0.406: v69.85,16.19 v66.67,16.19
N$50
  Top 0.305: L1.1 62.72,7.62 64.14,7.62 64.14,9.84 63.82,10.48 63.82,11.43 64.82,12.43 U3.2
N$51
  Top 0.813: 1.27,20.64 1.27,16.51
N$52
  Top 0.813: U1.CH_PD 40.32,29.74 R14.1
N$53  (via drill 0.6)
  other vias: 11.75,23.81
N$54  (via drill 0.6)
  other vias: 13.65,23.81
N$55  (via drill 0.6)
  other vias: 13.65,21.91
N$56  (via drill 0.6)
  other vias: 11.75,21.91
N$59  (1 unrouted)
N$60  (1 unrouted)
VCC  (via drill 0.6)  (4 unrouted)
  Top 0.305: IC1.9 11.7,19.64 10.16,18.1 JP1.2 | 5.18,26.7 5.18,27.52 v5.08,27.62 | R9.2 22.3,18.98 v22.23,19.05 | U$3.7 37.47,12.06 38.1,12.7 40.96,12.7 43.18,10.48 48.58,10.48 51.75,13.65 53.66,13.65 54.61,12.7 54.61,10.16 54.29,9.84 54.36,9.78
  Top 0.406: 7.62,29.21 C2.1 5.18,26.7
  Top 0.61: R9.2 24.84,18.98 27.3,16.51 27.87,16.51 R10.2 28.01,16.51 29.84,16.51 30.48,15.88 30.48,13.34 31.75,12.06 | U$3.7 31.75,12.06 | 31.75,12.06 29.21,9.53 U$3.4 26.04,9.53 25.4,8.89 25.4,6.99 26.04,6.35 27.89,6.35 C16.1 | C14.1 5.35,29.89 6.35,28.89 7.37,28.89 C2.1
  Top 0.813: JP1.2 10.16,15.56 9.76,15.16 9.76,11.43 8.97,10.64
  Bottom 0.305: v5.08,27.62 5.08,21.27 7.3,19.05 9.84,19.05 10,18.89 | 10,18.89 10.16,18.73 JP1.2 | v22.23,19.05 10.16,19.05 10,18.89
(copper drawn outside any net)
  shapes: Bottom area x3

### Text on the board
tPlace: LoRa-Node / Masterarbeit / Adrian Heeren / Jade HS 6011057